# Altium schematic sheet programming.SchDoc: Fault-Tolerant Quadcopter
size A; DrawnBy: Vaughn Kottler; Engineer: Vaughn Kottler; Revision: A
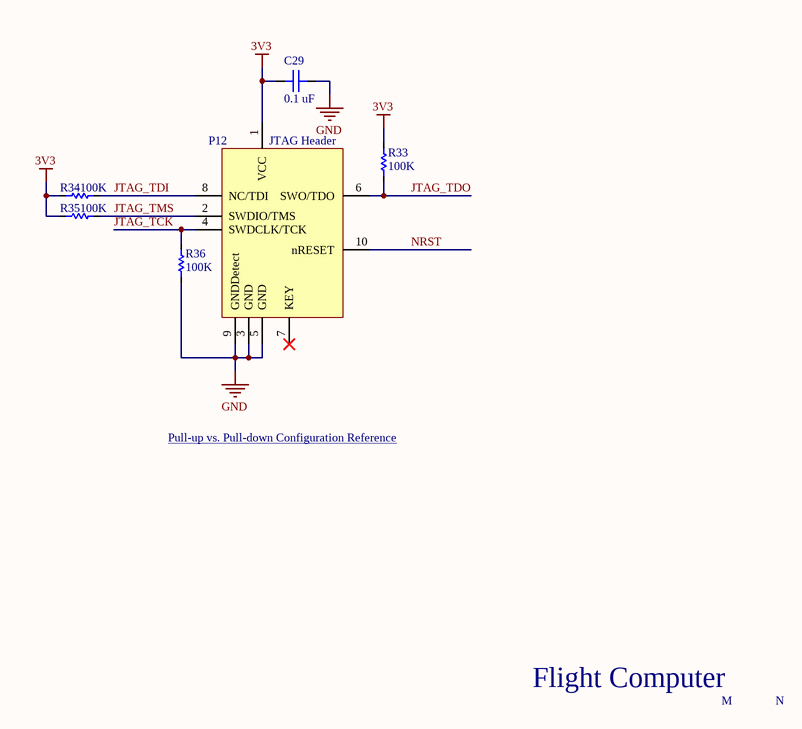
[diagram p0: programming.SchDoc]

## Parts
C29  0.1 uF  [CAP-CER-0805-SHORT]
P12  JTAG Header  [SMD Header 5x2x1.27mm]
R33  100K  [RES-0805]
R34  100K  [RES-0805]
R35  100K  [RES-0805]
R36  100K  [RES-0805]

## Nets
3V3: C29.1 P12.1(VCC) R33.2 R34.2 R35.2
GND: C29.2 P12.3(GND) P12.5(GND) P12.9(GNDDetect) R36.1
JTAG_TCK: P12.4(SWDCLK/TCK) R36.2
JTAG_TDI: P12.8(NC/TDI) R34.1
JTAG_TDO: P12.6(SWO/TDO) R33.1
JTAG_TMS: P12.2(SWDIO/TMS) R35.1
NRST: P12.10(nRESET)

Not connected (* = marked no-connect by the designer): P12 7(KEY)*

## Notes on the sheet
- Pull-up vs. Pull-down Configuration Reference <http://support.code-red-tech.com/CodeRedWiki/HardwareDebugConnections>
- Flight Computer
- M
- N

## Library data of the parts
C29 = CAP-CER-0.1uF-25V: ±10%, 0805; ComponentLink1Description: Capacitor Book (Amazon); ComponentLink1URL: https://www.amazon.com/gp/product/B0728HBDRW/
P12 = 10-pin JTAG Header: Supplier 1: Arrow; Supplier Part Number 1: 3220-10-0300-00; ComponentLink1Description: Pinout; ComponentLink1URL: http://infocenter.arm.com/help/topic/com.arm.doc.faqs/attached/13634/cortex_debug_connectors.pdf
R33-R36 = RES-100K-1/8W: 0805; ComponentLink1Description: Resistor Book (Amazon); ComponentLink1URL: https://www.amazon.com/gp/product/B071J21FYF/